# Altium schematic sheet sens.SchDoc
size 209 x 297 mm; DocumentCode: Децимальный номер; SchemeType: Схема электрическая принципиальная; PageSetup: Record=PageOptionsZCenterHorizontal=TrueZCenterVertical=TrueZPrintScale=0.95ZXCorrection=1.00ZYCorrection=1.00ZPrintKind=2ZBorderSize=5000000ZLeftOffset=0ZBottomOffset=0ZOrientation=1ZPaperLength=1000ZPaperWidth=1000ZScale=100ZPaperSource=7ZPrintQuality=600ZMediaType=1ZDitherType=10ZPaperKind=A4 (210 x 297 мм)ZPrintScaleMode=1
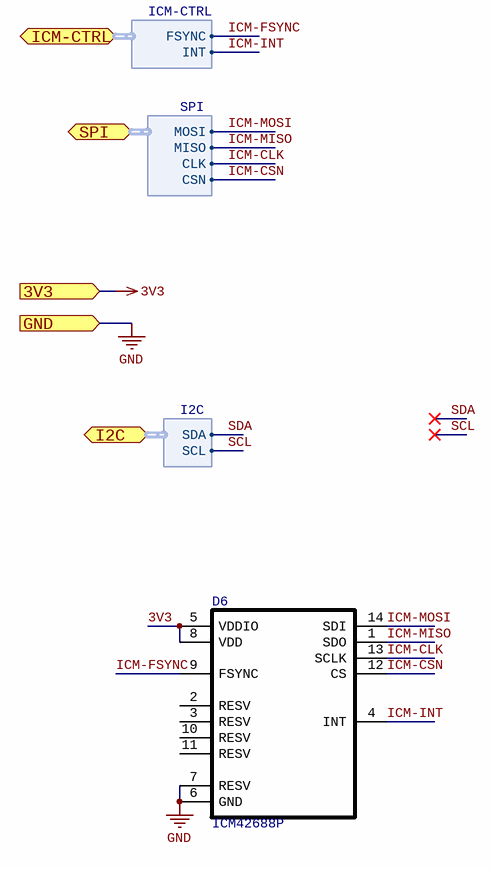
[diagram p0: sens.SchDoc]

## Parts
D6  ICM42688P  [LGA-14]

## Ports
3V3 (in), GND (in), I2C (harness I2C), ICM-CTRL (harness ICM-CTRL), SPI (harness SPI)

## Harnesses
ICM-CTRL: FSYNC, INT
SPI: MOSI, MISO, CLK, CSN
I2C: SDA, SCL

## Nets
3V3: D6.5(VDDIO) D6.8(VDD) ; port 3V3
GND: D6.6(GND) D6.7(RESV) ; port GND
ICM-CLK: D6.13(SCLK) ; port SPI.CLK
ICM-CSN: D6.12(CS) ; port SPI.CSN
ICM-FSYNC: D6.9(FSYNC) ; port ICM-CTRL.FSYNC
ICM-INT: D6.4(INT) ; port ICM-CTRL.INT
ICM-MISO: D6.1(SDO) ; port SPI.MISO
ICM-MOSI: D6.14(SDI) ; port SPI.MOSI
SCL: port I2C.SCL
SDA: port I2C.SDA

Not connected (* = marked no-connect by the designer): D6 2(RESV) 3(RESV) 10(RESV) 11(RESV)

## Notes on the sheet
- Перв. примен.
- Справ. №
- Подп. и дата
- Инв. № дубл.
- Взам. инв. №
- Изм.
- Лист
- № докум.
- Подп.
- Дата
- Инв. № подл.
- Копировал
- Формат А4

## Library data of the parts
D6 = ICM42688P: Гироскоп, акселерометр; Part Number: ICM42688P